# Altium project ATS-1-Panel.PrjPcb
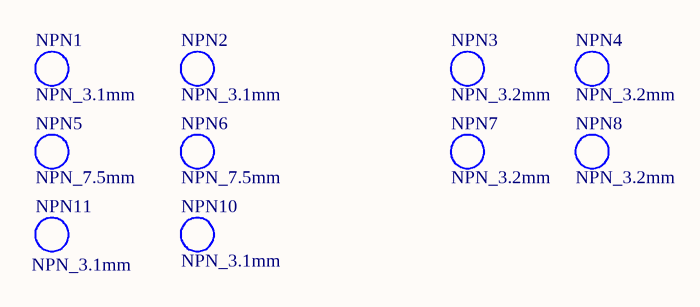
[diagram p0: ATS-1-Panel.SchDoc]
ProjectRevision: REV 1.1; CreatorSchematic: M. Rubin; CompanyName: M3 Instruments; ApprovalSchematic: M. Rubin; Address4: Germany; Address3: 10965 Berlin; Address2: Kreuzbergstraße 43
1 sheet, 10 parts. Net scope: global (net labels, ports and power ports of the same name join across sheets).
Board file: snr-0007.PcbDoc

## Sheet ATS-1-Panel.SchDoc: ATS-1-Panel
size A4; SheetNumber: 1; SheetTotal: 1

### Parts
NPN1  NPN_3.1mm  [HOLE_NPH_3.1_LED_3mm]
NPN2  NPN_3.1mm  [HOLE_NPH_3.1_LED_3mm]
NPN3  NPN_3.2mm  [HOLE_NPH_3.2_M3]
NPN4  NPN_3.2mm  [HOLE_NPH_3.2_M3]
NPN5  NPN_7.5mm  [HOLE_NPH_7.5_F01]
NPN6  NPN_7.5mm  [HOLE_NPH_7.5_F01]
NPN7  NPN_3.2mm  [HOLE_NPH_3.2_M3]
NPN8  NPN_3.2mm  [HOLE_NPH_3.2_M3]
NPN10  NPN_3.1mm  [HOLE_NPH_3.1_LED_3mm]
NPN11  NPN_3.1mm  [HOLE_NPH_3.1_LED_3mm]

### Notes on the sheet
- Title
- Size:
- Date:
- File:
- A4
- Revision:
- Sheet
- of
- Creator:
- Document Type: Schematic Drawing
- Approval Person:

### Library data of the parts
NPN1 NPN2 NPN10 NPN11 = NPH_3.1mm_LED_3mm
NPN3 NPN4 NPN7 NPN8 = NPH_3.2mm_M3
NPN5 NPN6 = NPH_7.5mm_F01